# Altium schematic sheet Preamplifier.SchDoc
size A3; Organization: Altium Limited; Address1: L3, 12a Rodborough Rd; Address2: Frenchs Forest; Address3: NSW; Address4: Australia 2086; DocumentNumber: 2; SheetNumber: 2; SheetTotal: 19
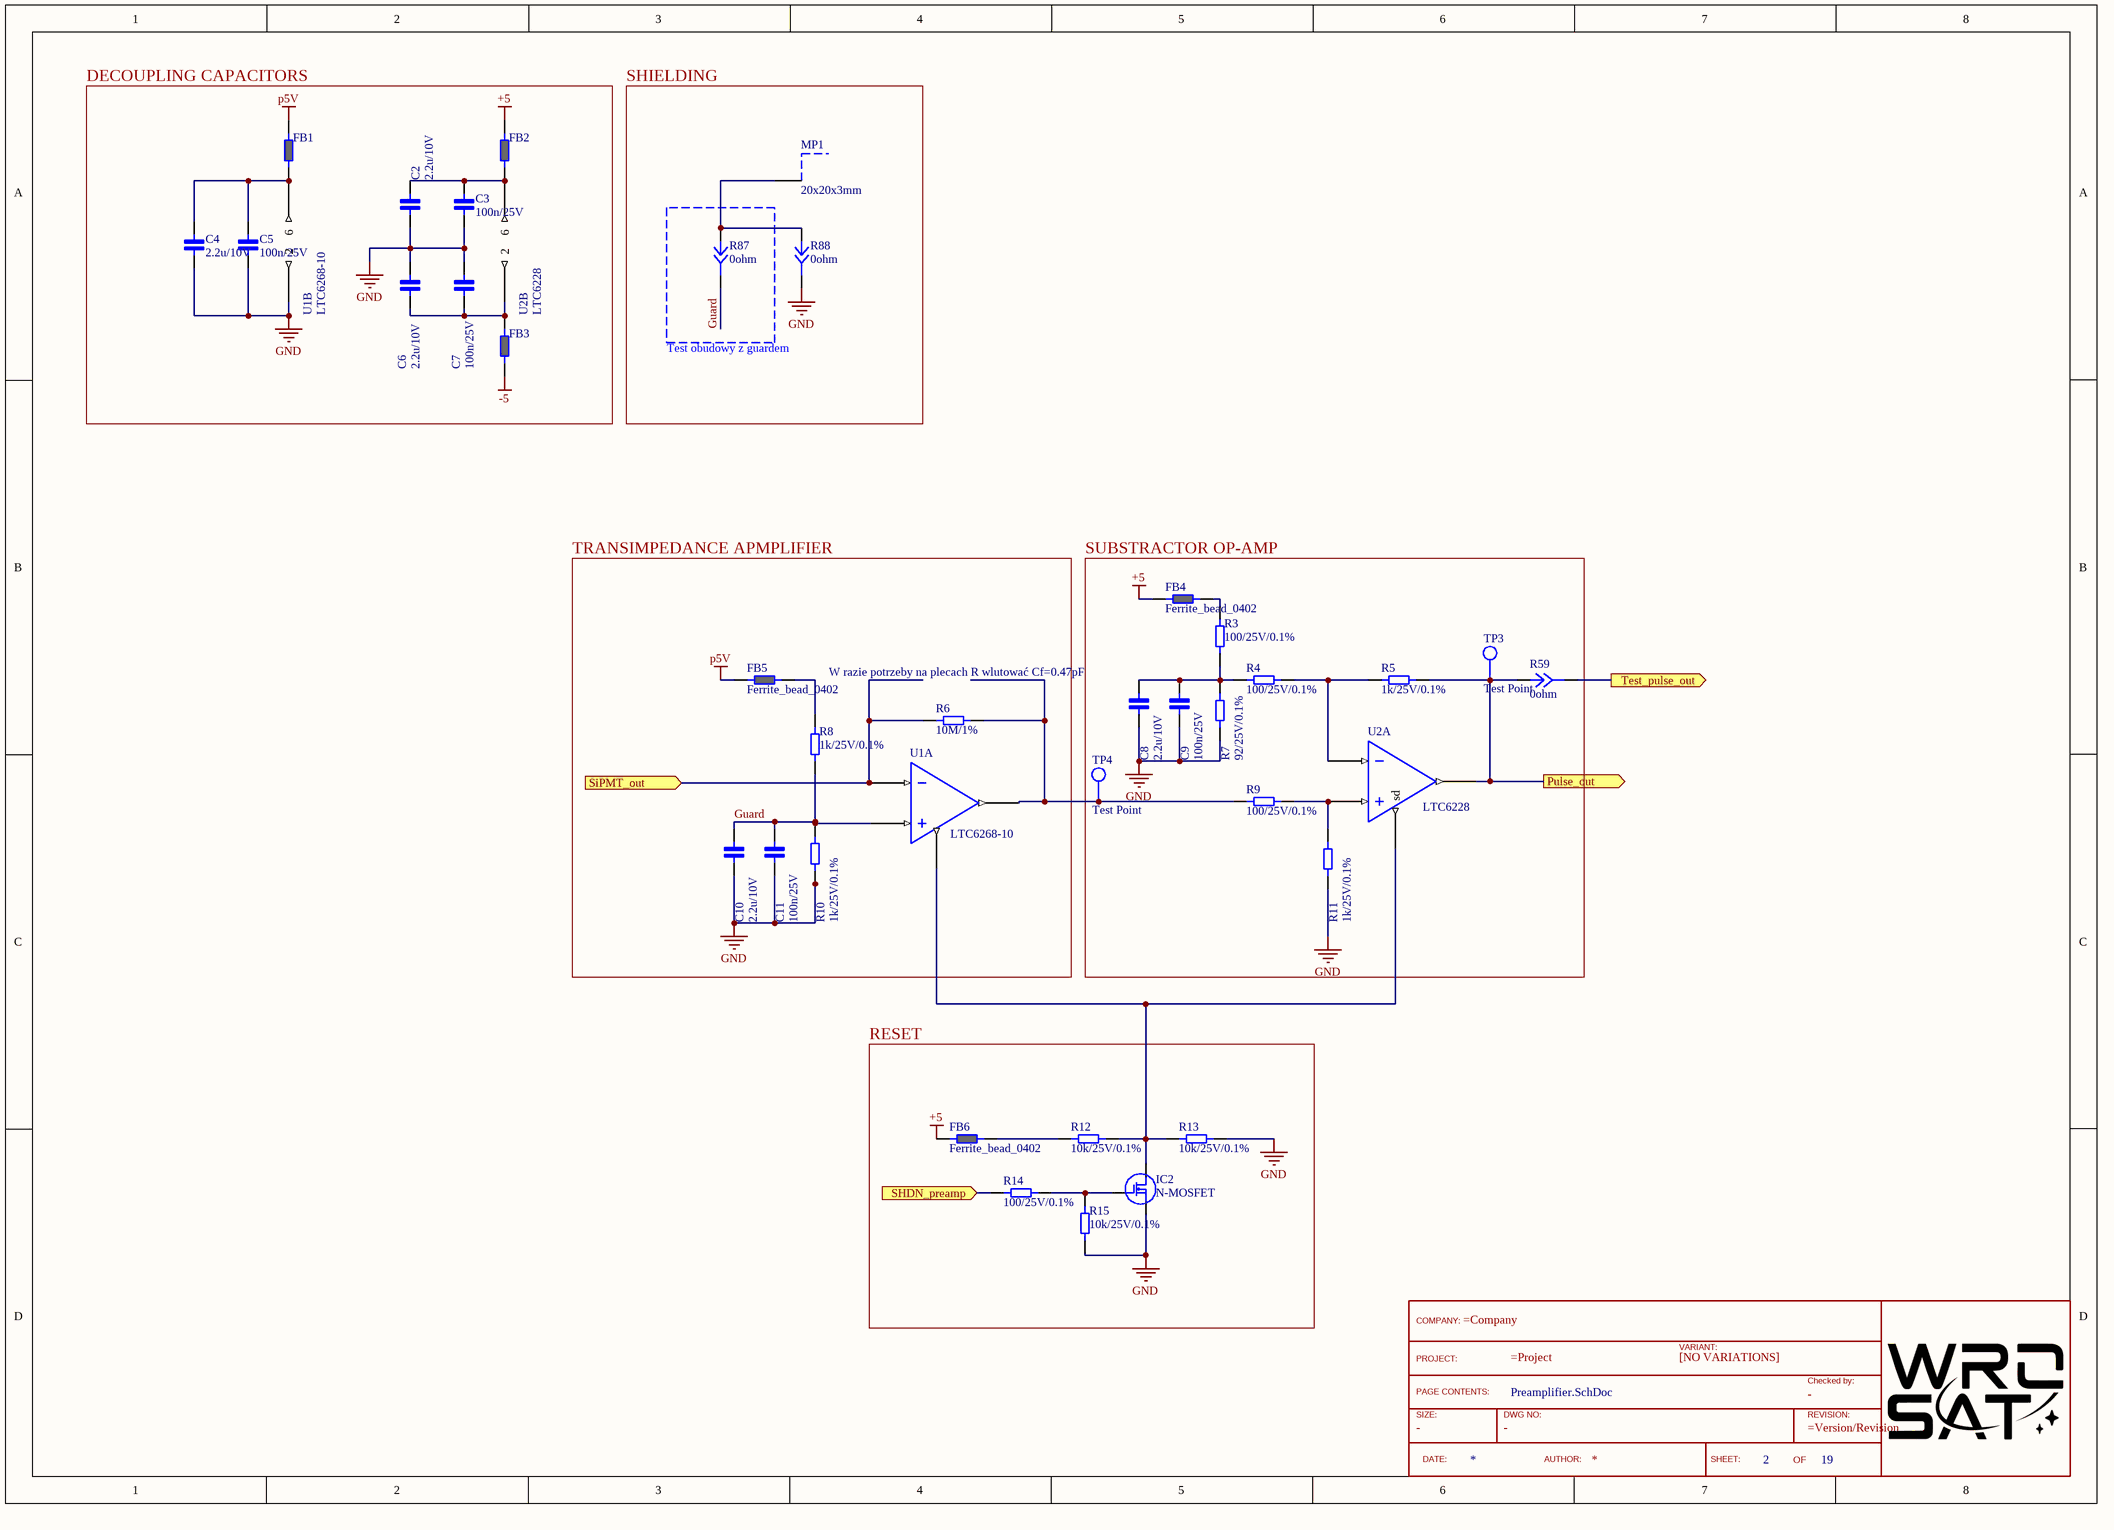
[diagram p0: Preamplifier.SchDoc]

## Parts
?  TitleBlock  (value not drawn)  (graphical)
C2  2.2u/10V  [Cap_0402]
C3  100n/25V  [Cap_0402]
C4  2.2u/10V  [Cap_0402]
C5  100n/25V  [Cap_0402]
C6  2.2u/10V  [Cap_0402]
C7  100n/25V  [Cap_0402]
C8  2.2u/10V  [Cap_0402]
C9  100n/25V  [Cap_0402]
C10  2.2u/10V  [Cap_0402]
C11  100n/25V  [Cap_0402]
FB1  Ferrite_bead_0402  [FERRITE_0402]  (value not drawn)
FB2  Ferrite_bead_0402  [FERRITE_0402]  (value not drawn)
FB3  Ferrite_bead_0402  [FERRITE_0402]  (value not drawn)
FB4  Ferrite_bead_0402  [FERRITE_0402]
FB5  Ferrite_bead_0402  [FERRITE_0402]
FB6  Ferrite_bead_0402  [FERRITE_0402]
IC2  N-MOSFET  [SOT23-3]
MP1  20x20x3mm  [36103205S]
R3  100/25V/0.1%  [RES_0402]
R4  100/25V/0.1%  [RES_0402]
R5  1k/25V/0.1%  [RES_0402]
R6  10M/1%  [RES_1206_prec]
R7  92/25V/0.1%  [RES_0402]
R8  1k/25V/0.1%  [RES_0402]
R9  100/25V/0.1%  [RES_0402]
R10  1k/25V/0.1%  [RES_0402]
R11  1k/25V/0.1%  [RES_0402]
R12  10k/25V/0.1%  [RES_0402]
R13  10k/25V/0.1%  [RES_0402]
R14  100/25V/0.1%  [RES_0402]
R15  10k/25V/0.1%  [RES_0402]
R59  0ohm  [Jumper 2]
R87  0ohm  [Jumper 2]
R88  0ohm  [Jumper 2]
TP3  Test Point  [Test Point SMT]
TP4  Test Point  [Test Point SMT]
U1  LTC6268-10  [SOT-23-6]  (parts A,B of 2)
U2  LTC6228  [SOT-23-6]  (parts A,B of 2)

## Blocks framed on the sheet
DECOUPLING CAPACITORS: C2-C7 FB1-FB3 U1 U2
SHIELDING: MP1 R87 R88
TRANSIMPEDANCE APMPLIFIER: C10 C11 FB5 R6 R8 R10 U1
SUBSTRACTOR OP-AMP: C8 C9 FB4 R3-R5 R7 R9 R11 R59 TP3 TP4 U2
RESET: FB6 IC2 R12-R15

## Ports
Pulse_out (out), SHDN_preamp (in), SiPMT_out (in), Test_pulse_out (out)

## Nets
+5: FB2.2 FB4.1 FB6.1
-5: FB3.1
GND: C2.1 C3.1 C4.1 C5.1 C6.2 C7.2 C8.1 C9.1 C10.1 C11.1 IC2.2(S) R7.1 R10.1 R11.1 R13.2 R15.1 R88.2 U1.2
p5V: FB1.2 FB5.1
Guard: C10.2 C11.2 R8.1 R10.2 R87.2 U1.3
Pulse_out: R5.2 R59.1 TP3.1 U2.1 ; port Pulse_out
SHDN_preamp: R14.1 ; port SHDN_preamp
SiPMT_out: R6.1 U1.4 ; port SiPMT_out
Test_pulse_out: R59.2 ; port Test_pulse_out
NetC2_2: C2.2 C3.2 FB2.1 U2.6
NetC4_2: C4.2 C5.2 FB1.1 U1.6
NetC6_1: C6.1 C7.1 FB3.2 U2.2
NetC8_2: C8.2 C9.2 R3.1 R4.1 R7.2
NetFB4_2: FB4.2 R3.2
NetFB5_2: FB5.2 R8.2
NetFB6_2: FB6.2 R12.1
NetIC2_1: IC2.1(G) R14.2 R15.2
NetIC2_3: IC2.3(D) R12.2 R13.1 U1.5(sd) U2.5(sd)
NetMP1_1: MP1.1 R87.1 R88.1
NetR4_2: R4.2 R5.1 U2.4
NetR6_2: R6.2 R9.1 TP4.1 U1.1
NetR9_2: R9.2 R11.2 U2.3

## Notes on the sheet
- Test obudowy z guardem
- (near C8) W razie potrzeby na plecach R wlutować Cf=0.47pF
- Title
- Size:
- Date:
- A3
- Number:
- Time:
- Revision:
- Sheet
- of
- File:
- (in symbol TitleBlock) COMPANY:; VARIANT:; PROJECT:; [NO VARIATIONS]; Checked by:; PAGE CONTENTS:; SIZE:; DWG NO:; REVISION:; DATE:; AUTHOR:; SHEET:; OF

## Library data of the parts
? = TitleBlock: Standard TitleBlock; DrawingNo: -; Size: -; Checked: -
C2 C4 C6 C8 C10 = Cap_0402_2.2u: Ceramic Capacitor 2.2uF / 0402 / 10V / ±5%, Wurth Elektronik MLCC
C3 C5 C7 C9 C11 = Cap_0402_100n: Ceramic Capacitor 100n / 0402 / 25V / ±5%, Wurth Elektronik MLCC; ComponentLink1Description: New link; ComponentLink1URL: https://www.we-online.com/catalog/en/WCAP-CSGP-25VDC
FB1-FB6 = Ferrite_bead_0402: Ferrite bead, wurth 74269241102
IC2 = BSS138K: n-mosfet 50V, low threshold; Manufacturer: NXP Semiconductors; Manufacturer Part Number: BF861C; Supplier 1: Arrow Electronics; RoHS: Yes; Category: Uncategorized; Number of Pins: 3; ComponentLink1URL: http://docs-usa.electrocomponents.com/techlib:/itc_doclist_US.htm?stockno=6262412&src-supplier=Allied+Electronics; ComponentLink1Description: http://docs-usa.electrocomponents.com/techlib:/itc_doclist_US.htm?stockno=6262412&src-supplier=Allied+Electronics; Supplier Part Number 1: BF861C
MP1 = 36103205S: WE-SHC Shielding Cabinet, SMT Frame, Tin Plated, Tray, 20x20x3mm; Manufacturer: Wurth Elektronik; Base Material: Steel; ComponentLink1Description: Manufacturer; ComponentLink1URL: http://www.we-online.de; ComponentLink2Description: Datasheet; ComponentLink2URL: https://www.we-online.com/catalog/datasheet/36103205S.pdf; Operating Temperature: -40 to +125degC; Packaging: Tray; Plating: Tin; Length: 20mm; Type: SMD Frame; Height: 3mm; Manufacturer Part Number: 36103205S; Mounting Technology: SMT; Published Date: April 2020; Width: 20mm
R3 R4 R9 R14 = Res_0402_100: Vishay, thin film resistor 100/25V/0.1%
R5 R8 R10 R11 = Res_0402_1k: Vishay, thin film resistor 1k/25V/0.1%
R6 = Prec_res_10M: Res Thin Film 1206 10M Ohm 0.1% 0.33W(1/3W) ±50ppm/C Sulfur Resistant Pad SMD T/R; Manufacturer: Vishay Dale; Manufacturer Part Number: P1206H1005BGT; Temperature Coefficient: 50ppm/°C; Resistance: 10MR; Supplier 1: Mouser; RoHS: No; Category: Chip SMD Resistors; Stock 1: 96; Pricing 1: 1=7.55000, 10=6.80000, 50=6.19000, 100=5.59000, 200=5.14000, 500=4.68000, 1000=4.08000, 2500=3.93000, 5000=3.77000 (USD); Case/Package: 1206; Contact Plating: Gold; Min Operating Temperature: -55°C; Max Operating Temperature: 155°C; Resistor Type: Thin Film; Tolerance: 0.1%; Packaging: Tape and Reel; Radiation Hardening: No; ComponentLink1URL: https://datasheet.ciiva.com/9051/p-9051054.pdf?src-supplier=Avnet; ComponentLink1Description: https://datasheet.ciiva.com/9051/p-9051054.pdf?src-supplier=Avnet
R7 = Res_0402_92: Vishay, thin film resistor 92/25V/0.1%
R12 R13 R15 = Res_0402_10k: Vishay, thin film resistor 10k/25V/0.1%
R59 R87 R88 = Jumper
U1 = LTC6268: 4 ghz, ultra-low noise opamp; ComponentLink1Description: New link; ComponentLink1URL: https://pl.mouser.com/datasheet/2/609/626810f-1279531.pdf
U2 = LTC6228: 0.88nV/√Hz 730MHz, 500V/µs, / Low Distortion Rail-to-Rail Output Op / Amps with Shutdown; ComponentLink1Description: New link; ComponentLink1URL: https://pl.mouser.com/datasheet/2/609/LTC6228_6229-1660243.pdf